# Altium schematic sheet Capteurs_Schematic.SchDoc: Capteurs
size A4; Date: 14/04/2026; DrawnBy: JACOLOT Marine & GUILLEMOT Killian; Revision: Rev A; SheetNumber: 3; SheetTotal: 4
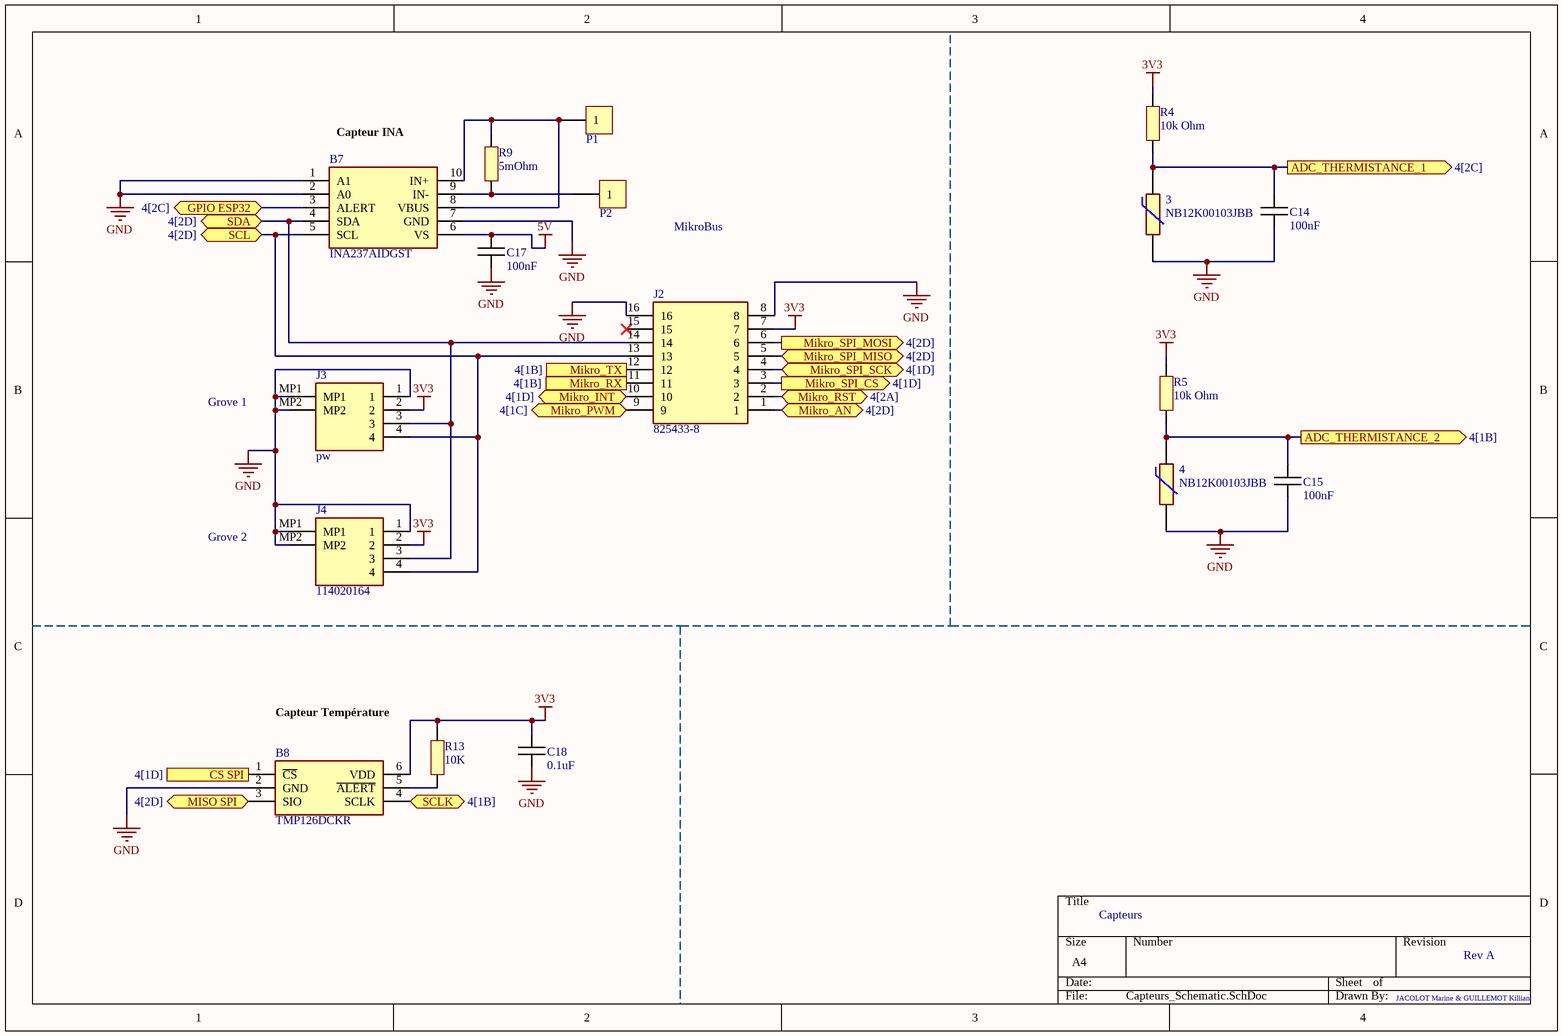
[diagram p0: Capteurs_Schematic.SchDoc]

## Parts
3  NB12K00103JBB  [RESC2212X50N]
4  NB12K00103JBB  [RESC2212X50N]
B7  INA237AIDGST  [SOP50P490X110-10N]
B8  TMP126DCKR  [SOT65P210X110-6N]
C14  100nF  [CAPC1005X06N]
C15  100nF  [CAPC1005X06N]
C17  100nF  [CAPC1005X06N]
C18  0.1uF  [CAPC1005X06N]
J2  825433-8  [Connect-Mikrobus]
J3  pw  [114020164]
J4  114020164  [114020164]
P1  Plage CMS 10x5  [Plage CMS 10x5]  (value not drawn)  (no BOM)
P2  Plage CMS 10x5  [Plage CMS 10x5]  (value not drawn)  (no BOM)
R4  10k Ohm  [RESC1005X06N]
R5  10k Ohm  [RESC1005X06N]
R9  5mOhm  [RESC1005X06N]
R13  10K  [RESC1005X06N]

## Ports
ADC_THERMISTANCE_1 (out, see 4[2C]), ADC_THERMISTANCE_2 (out, see 4[1B]), CS SPI (out, see 4[1D]), GPIO ESP32 (bidir, see 4[2C]), Mikro_AN (bidir, see 4[2D]), Mikro_INT (bidir, see 4[1D]), Mikro_PWM (bidir, see 4[1C]), Mikro_RST (bidir, see 4[2A]), Mikro_RX (out, see 4[1B]), Mikro_SPI_CS (out, see 4[1D]), Mikro_SPI_MISO (bidir, see 4[2D]), Mikro_SPI_MOSI (out, see 4[2D]), Mikro_SPI_SCK (bidir, see 4[1D]), Mikro_TX (in, see 4[1B]), MISO SPI (bidir, see 4[2D]), SCL (bidir, see 4[2D]), SCLK (bidir, see 4[1B]), SDA (bidir, see 4[2D])

## Nets
3V3: B8.6(VDD) C18.1 J2.7 J3.2 J4.2 R4.1 R5.1 R13.2
5V: B7.6(VS) C17.1
GND: 3.2 4.2 B7.1(A1) B7.2(A0) B7.7(GND) B8.2(GND) C14.2 C15.2 C17.2 C18.2 J2.8 J2.16 J3.1 J3.MP1 J3.MP2 J4.1 J4.MP1 J4.MP2
ADC_THERMISTANCE_1: 3.1 C14.1 R4.2 ; port ADC_THERMISTANCE_1
ADC_THERMISTANCE_2: 4.1 C15.1 R5.2 ; port ADC_THERMISTANCE_2
CS SPI: B8.1(~{CS}) ; port CS SPI
GPIO ESP32: B7.3(ALERT) ; port GPIO ESP32
Mikro_AN: J2.1 ; port Mikro_AN
Mikro_INT: J2.10 ; port Mikro_INT
Mikro_PWM: J2.9 ; port Mikro_PWM
Mikro_RST: J2.2 ; port Mikro_RST
Mikro_RX: J2.11 ; port Mikro_RX
Mikro_SPI_CS: J2.3 ; port Mikro_SPI_CS
Mikro_SPI_MISO: J2.5 ; port Mikro_SPI_MISO
Mikro_SPI_MOSI: J2.6 ; port Mikro_SPI_MOSI
Mikro_SPI_SCK: J2.4 ; port Mikro_SPI_SCK
Mikro_TX: J2.12 ; port Mikro_TX
MISO SPI: B8.3(SIO) ; port MISO SPI
SCL: B7.5(SCL) J2.13 J3.4 J4.4 ; port SCL
SCLK: B8.4(SCLK) ; port SCLK
SDA: B7.4(SDA) J2.14 J3.3 J4.3 ; port SDA
NetB7_8: B7.8(VBUS) B7.10(IN+) P1.1 R9.2
NetB7_9: B7.9(IN-) P2.1 R9.1
NetB8_5: B8.5(~{ALERT}) R13.1

Not connected (* = marked no-connect by the designer): J2 15*

## Notes on the sheet
- (near B7) Capteur INA
- MikroBus
- Grove 1
- Grove 2
- Capteur Température

## Library data of the parts
3 4 = NB12K00103JBB: NTC SMD Thermistor, NB12K, 10K, 5% AVX 10k 0805 Protection NTC Thermistor, 5s, 2 x 1.25 x 1.3mm; Manufacturer_Name: Kyocera AVX; Geometry.Height: 0.5mm; Manufacturer_Part_Number: NB12K00103JBB; Mouser Part Number: 581-NB12K00103JBB; Mouser Price/Stock: https://www.mouser.co.uk/ProductDetail/AVX/NB12K00103JBB/?qs=4%252B6%252BTdINQeDPvI%252BQUQjJ3Q%3D%3D; Arrow Part Number: NB12K00103JBB; Arrow Price/Stock: https://www.arrow.com/en/products/nb12k00103jbb/avx; Datasheet Link: https://datasheet.datasheetarchive.com/originals/distributors/Datasheets-DGA6/551314.pdf
B7 = INA237AIDGST: Current Sense Amplifiers 85-V, 16-bit, I2C output current/voltage/power monitor with alert 10-VSSOP -40 to 125; Manufacturer_Name: Texas Instruments; Manufacturer_Part_Number: INA237AIDGST; Mouser Part Number: 595-INA237AIDGST
B8 = TMP126DCKR: Board Mount Temperature Sensors +/-0.25 C SPI temperature sensor with 175 C operation, CRC and slew-rate alert; Manufacturer_Name: Texas Instruments; Manufacturer_Part_Number: TMP126DCKR; Mouser Part Number: 595-TMP126DCKR
C14 C15 C17 C18 = Capacitor
J2 = Connect-Mikrobus: Headers & Wire Housings 8P double for connection mikrobus; Manufacturer_Name: TE Connectivity; Manufacturer_Part_Number: 825433-8; Mouser Part Number: 571-825433-8
J3 J4 = 114020164: Seeed Studio Accessories Grove Female Header - SMD-4P-2.0mm-90D-20Pcs; Manufacturer_Name: Seeed Studio; Manufacturer_Part_Number: 114020164; Mouser Part Number: 713-114020164
P1 P2 = Plage CMS 10x5: Plage de report CMS 10x5mm; PN: L30; Value: Plage CMS 10x5; Footprint_statut: ok
R4 R5 R9 R13 = Resistor